# EAGLE schematic frontend7 (EAGLE 8.5.2)
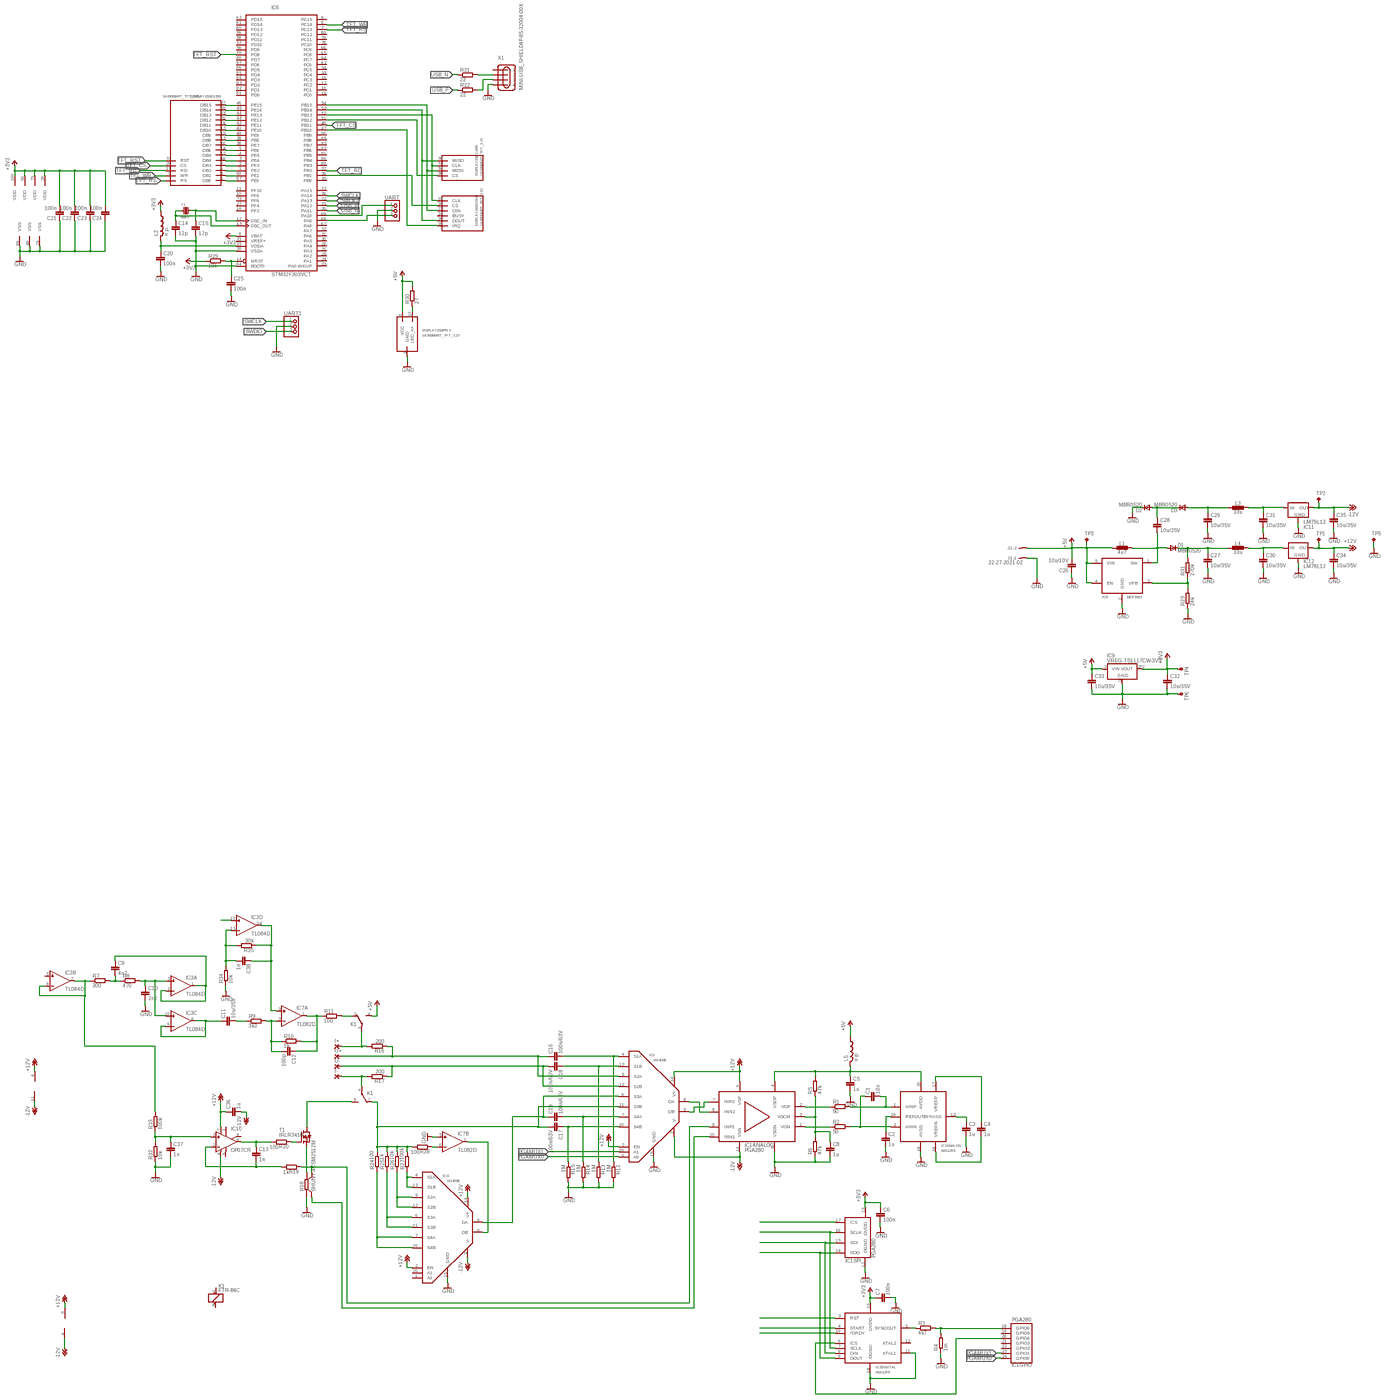
[diagram p0: schematic, sheet 1, overview]
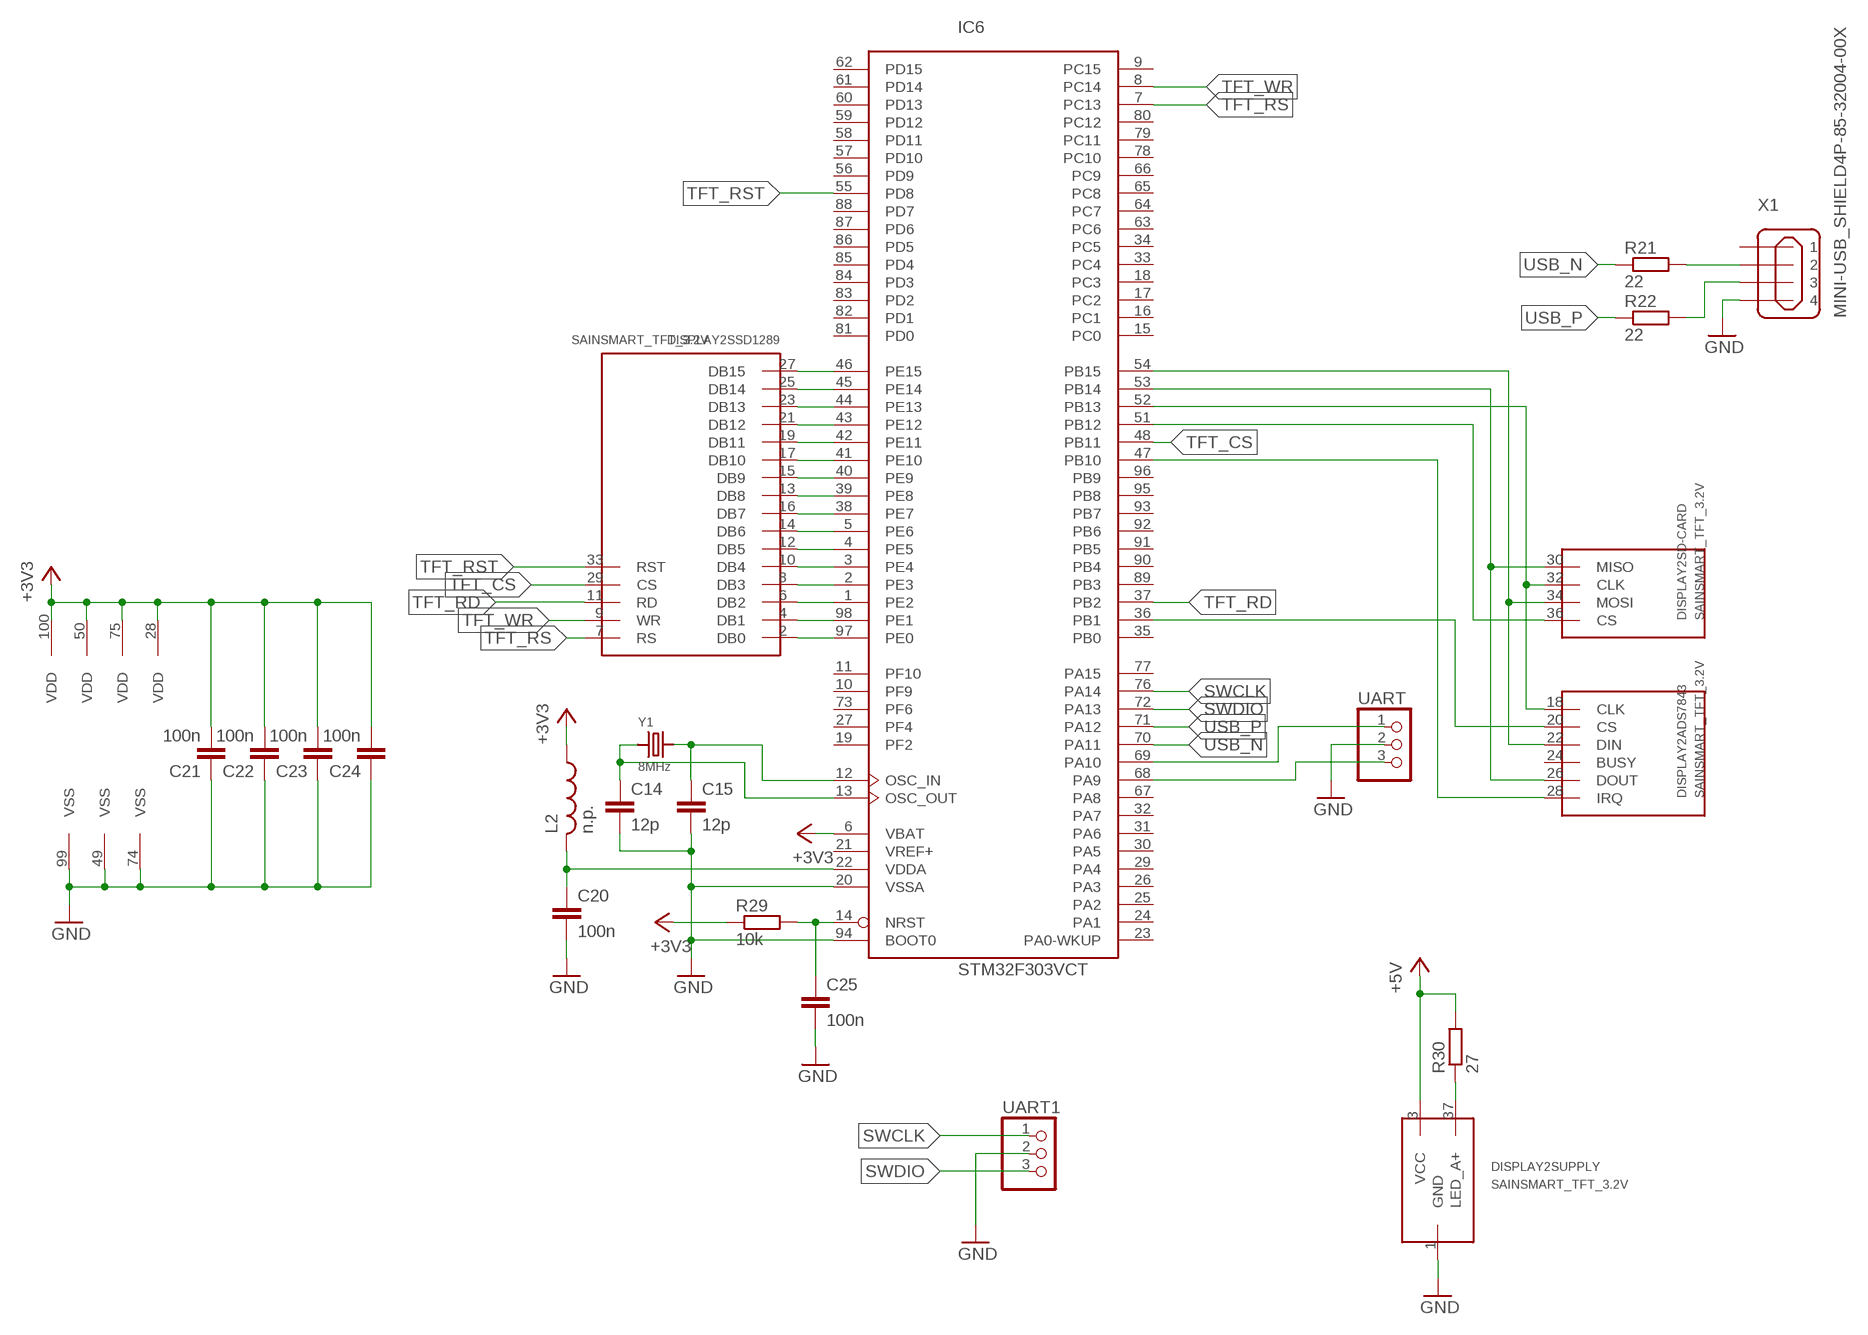
[diagram p1: schematic, sheet 1, part 1 of 4]
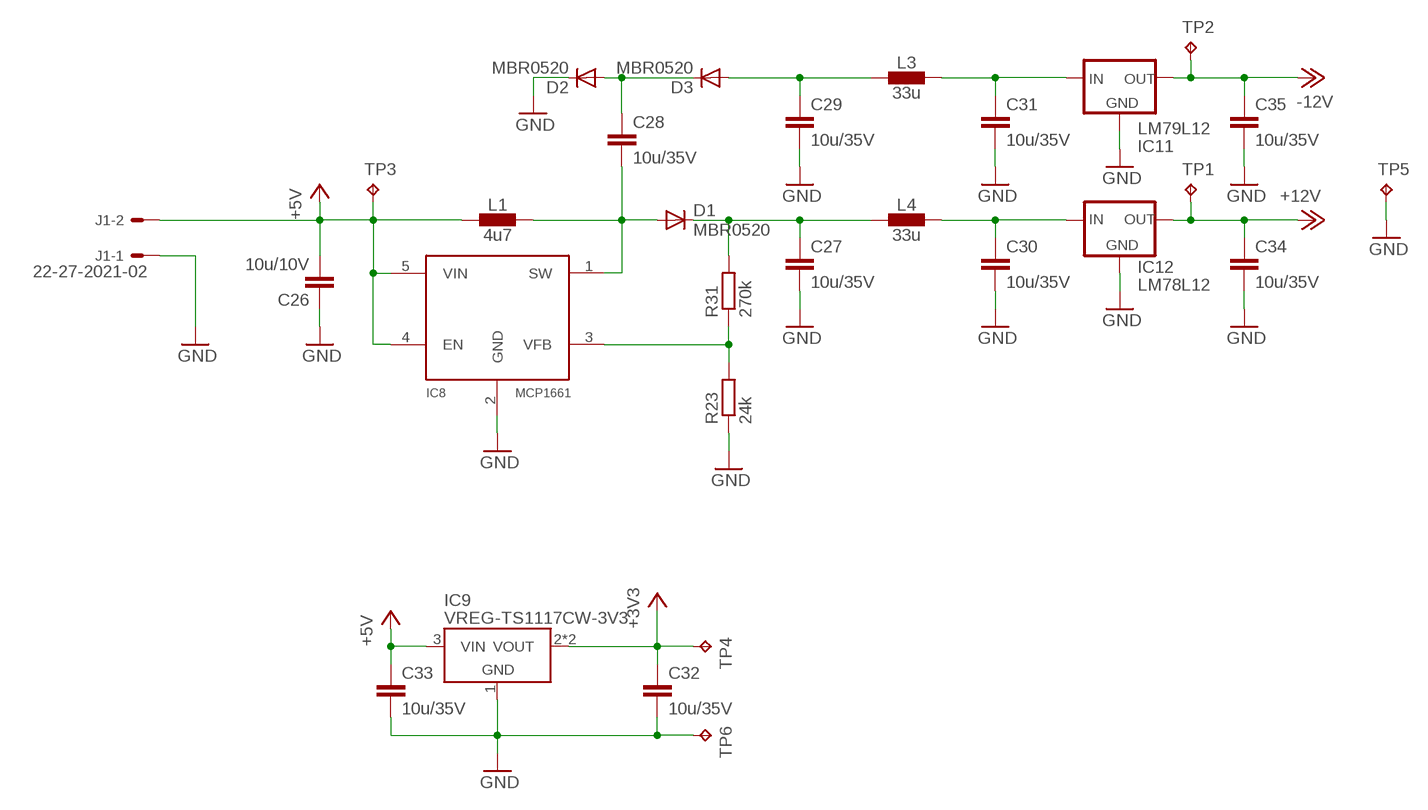
[diagram p2: schematic, sheet 1, part 2 of 4]
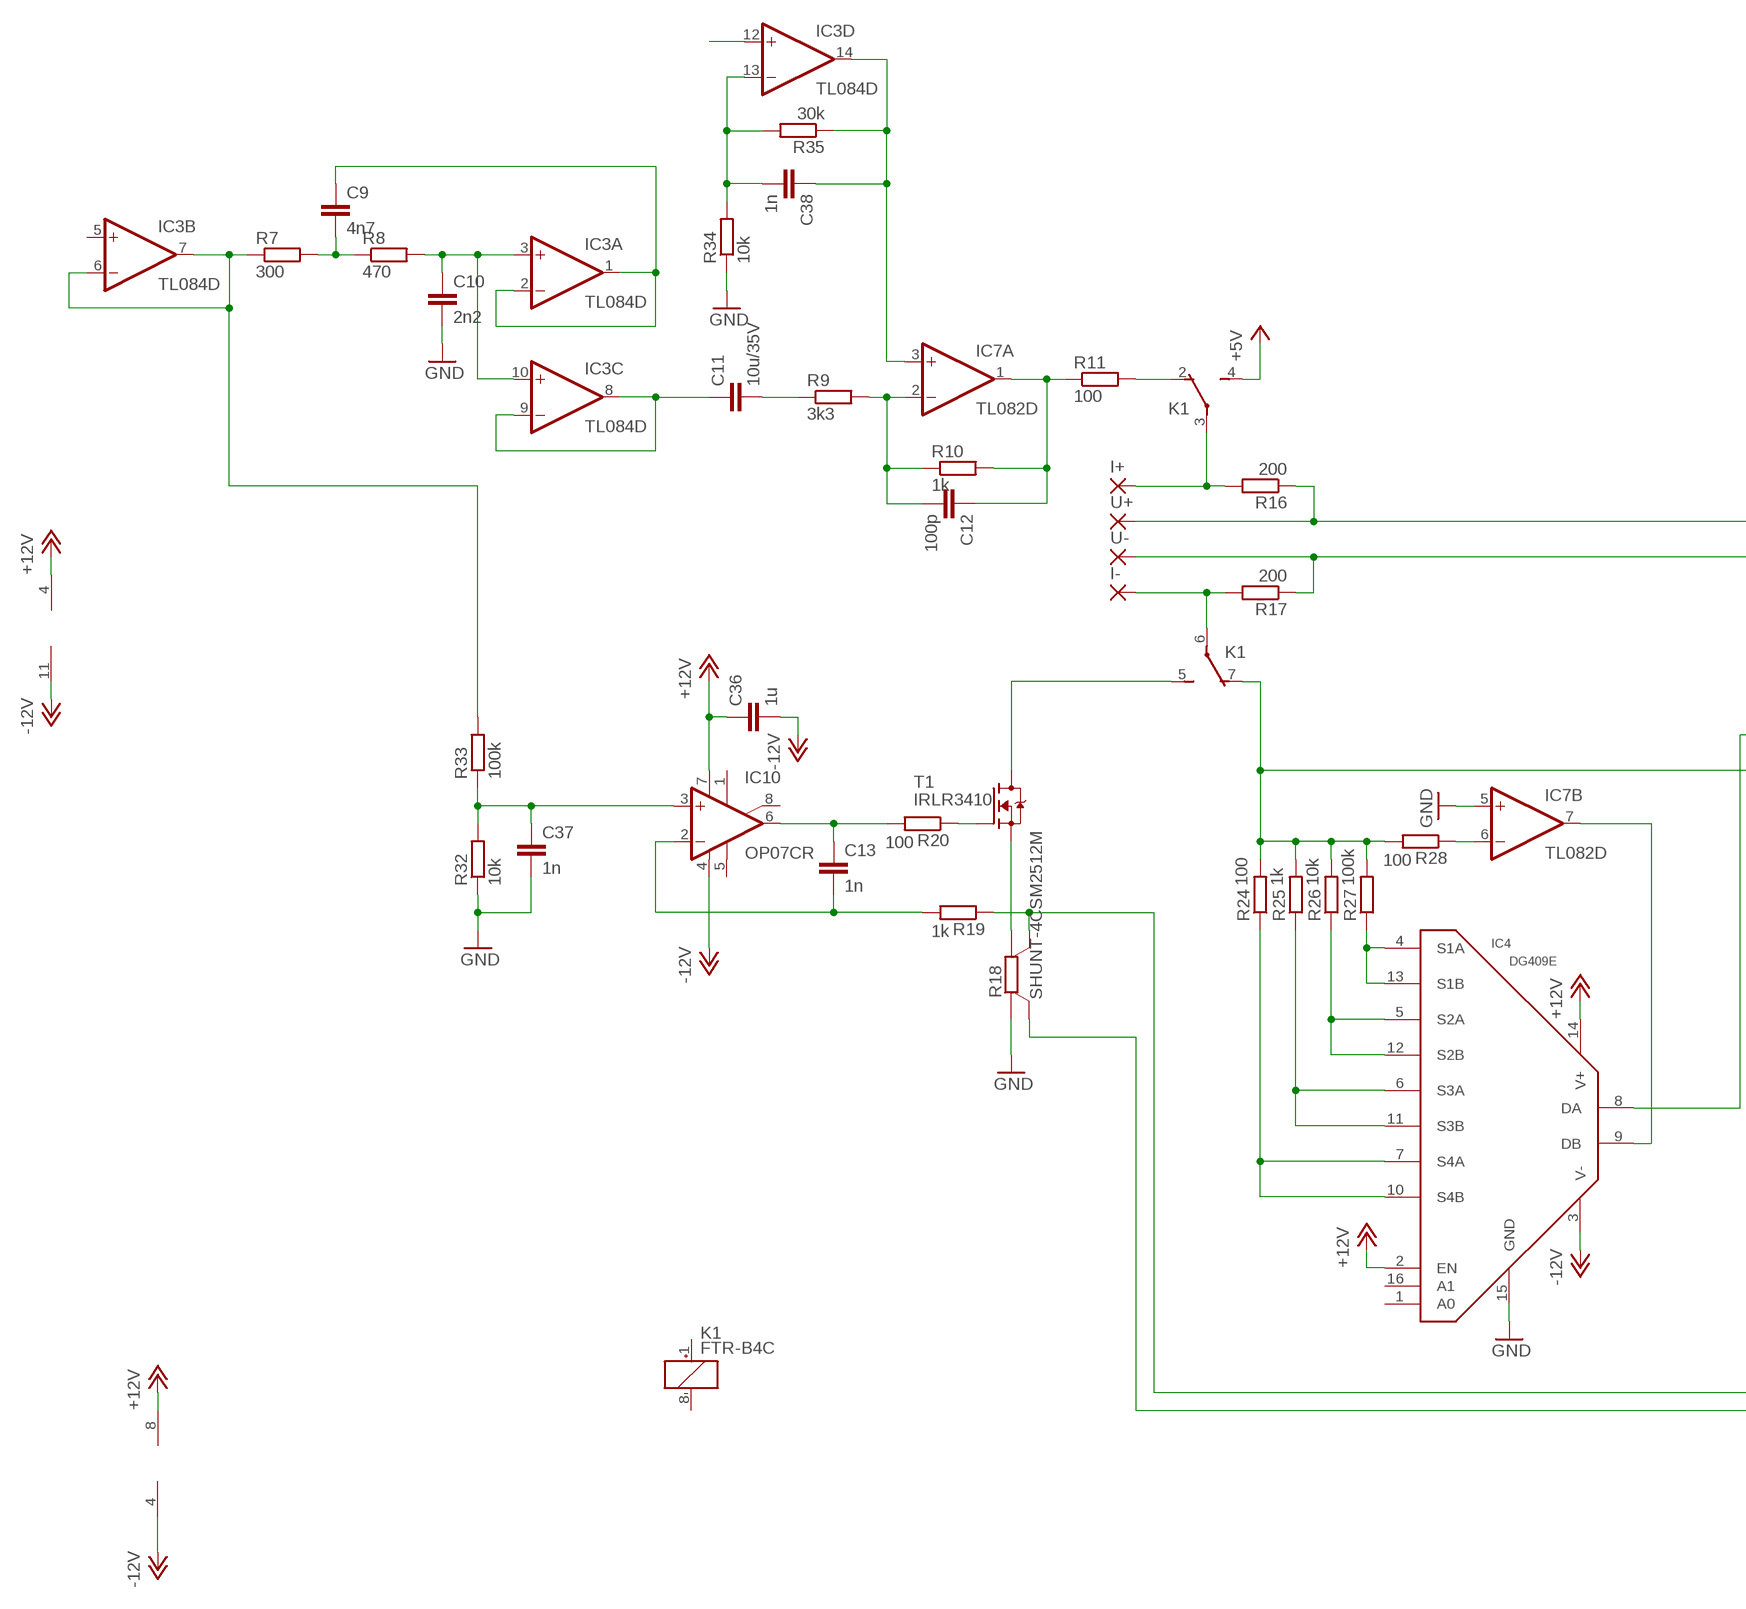
[diagram p3: schematic, sheet 1, part 3 of 4]
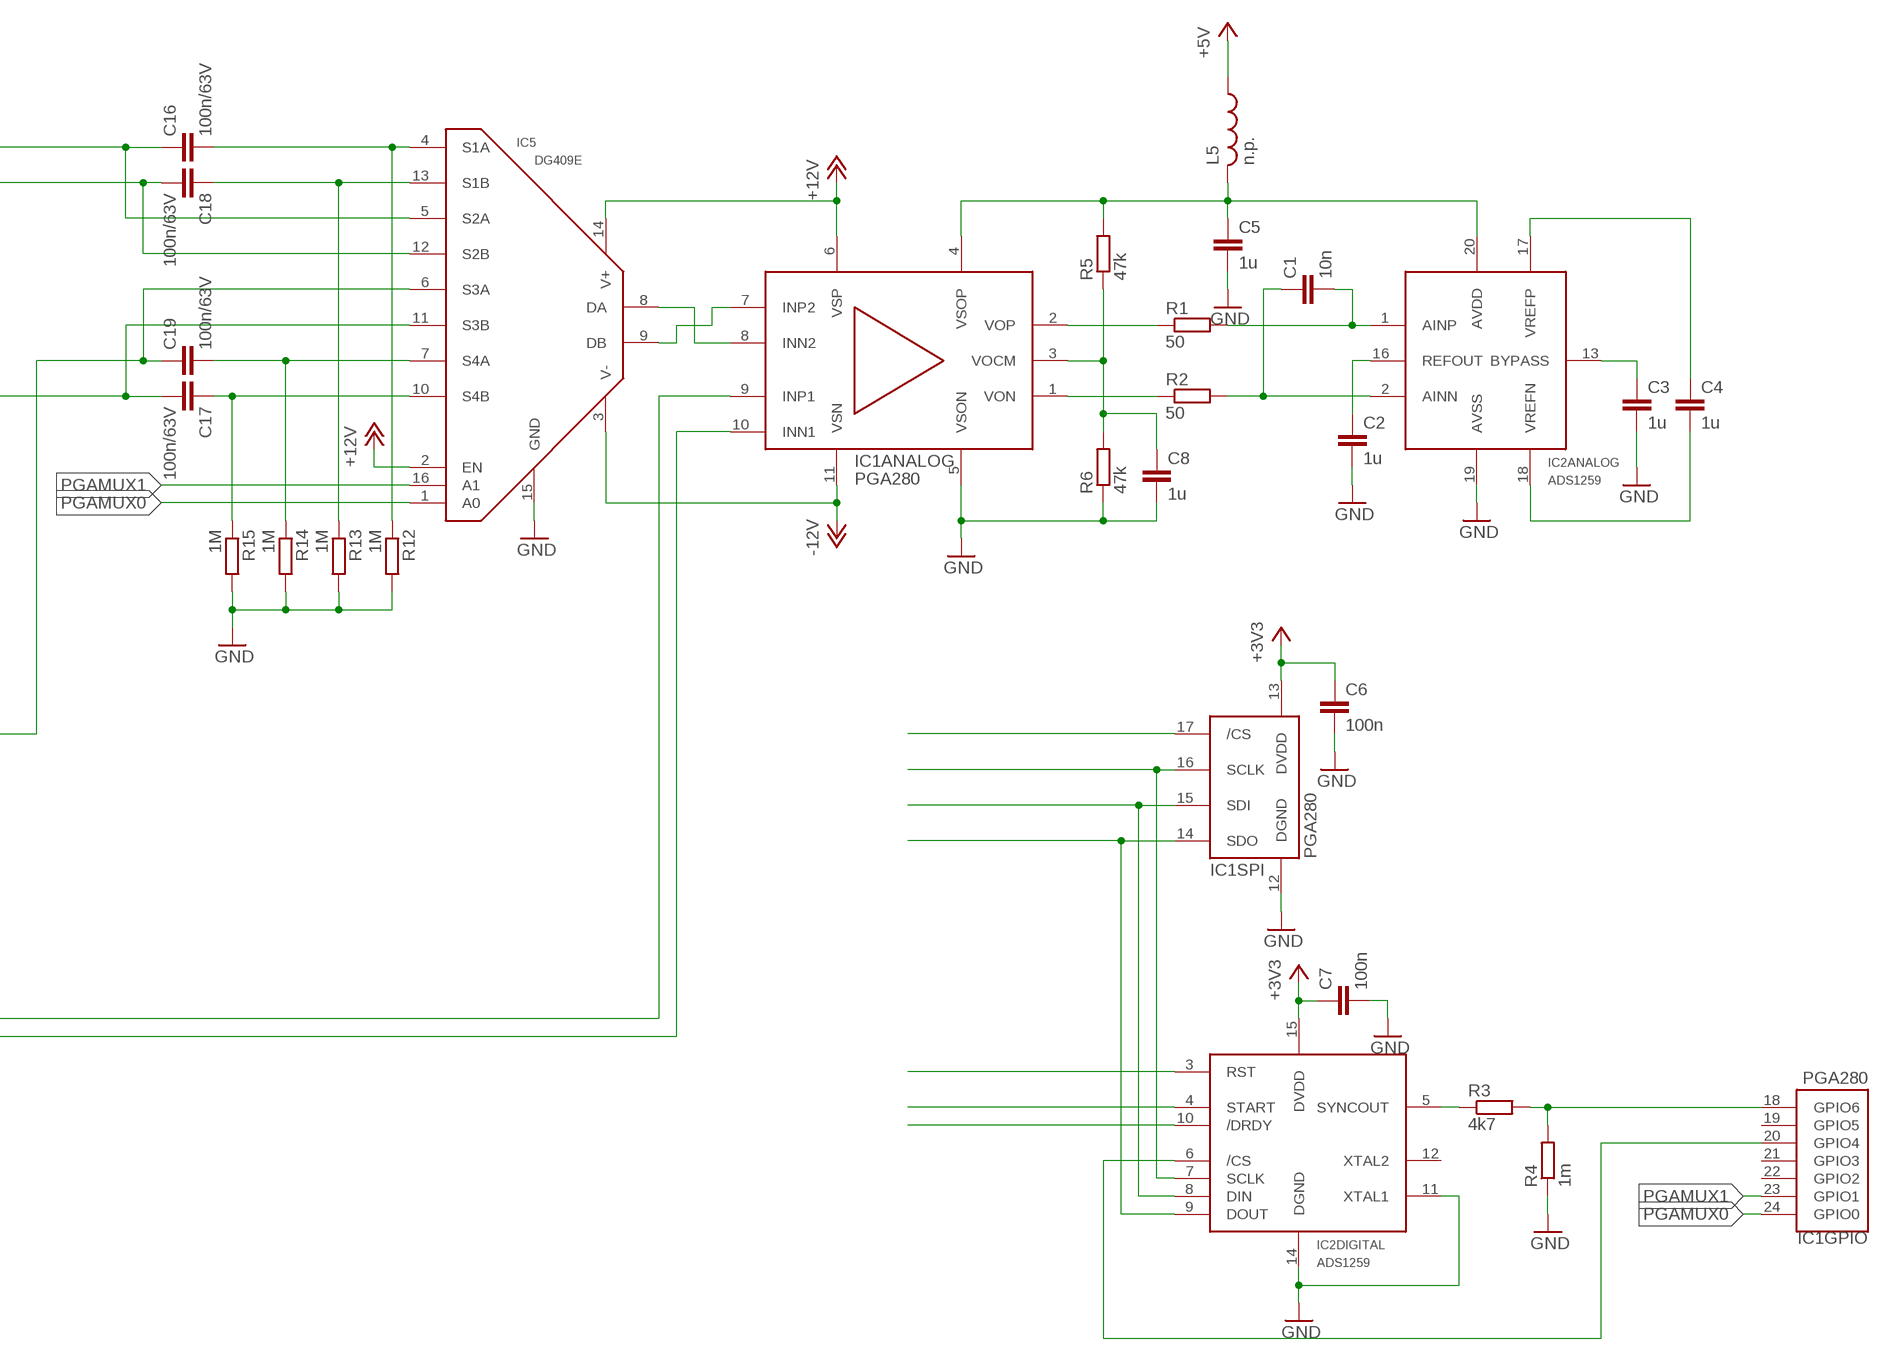
[diagram p4: schematic, sheet 1, part 4 of 4]

## Parts
C1  10n  C-EUC0603K  [C0603K]
C2  1u  C-EUC0603K  [C0603K]
C3  1u  C-EUC0603K  [C0603K]
C4  1u  C-EUC0603K  [C0603K]
C5  1u  C-EUC0603K  [C0603K]
C6  100n  C-EUC0603K  [C0603K]
C7  100n  C-EUC0603K  [C0603K]
C8  1u  C-EUC0603K  [C0603K]
C9  4n7  C-EUC0603K  [C0603K]
C10  2n2  C-EUC0603K  [C0603K]
C11  10u/35V  C-EUC1206K  [C1206K]
C12  100p  C-EUC0603K  [C0603K]
C13  1n  C-EUC0603K  [C0603K]
C14  12p  C-EUC0603K  [C0603K]
C15  12p  C-EUC0603K  [C0603K]
C16  100n/63V  C-EUC1206K  [C1206K]
C17  100n/63V  C-EUC1206K  [C1206K]
C18  100n/63V  C-EUC1206K  [C1206K]
C19  100n/63V  C-EUC1206K  [C1206K]
C20  100n  C-EUC0603K  [C0603K]
C21  100n  C-EUC0603K  [C0603K]
C22  100n  C-EUC0603K  [C0603K]
C23  100n  C-EUC0603K  [C0603K]
C24  100n  C-EUC0603K  [C0603K]
C25  100n  C-EUC0603K  [C0603K]
C26  10u/10V  C-EUC1206K  [C1206K]
C27  10u/35V  C-EUC1206K  [C1206K]
C28  10u/35V  C-EUC1206K  [C1206K]
C29  10u/35V  C-EUC1206K  [C1206K]
C30  10u/35V  C-EUC1206K  [C1206K]
C31  10u/35V  C-EUC1206K  [C1206K]
C32  10u/35V  C-EUC1206K  [C1206K]
C33  10u/35V  C-EUC1206K  [C1206K]
C34  10u/35V  C-EUC1206K  [C1206K]
C35  10u/35V  C-EUC1206K  [C1206K]
C36  1u  C-EUC0603K  [C0603K]
C37  1n  C-EUC0603K  [C0603K]
C38  1n  C-EUC0603K  [C0603K]
D1  MBR0520  DIODE-SOD123  [SOD123]
D2  MBR0520  DIODE-SOD123  [SOD123]
D3  MBR0520  DIODE-SOD123  [SOD123]
DISPLAY2  SAINSMART_TFT_3.2V  [SAINSMART_ANGLED]
I+  SMD5  [SMD2,54-5,08]
I-  SMD5  [SMD2,54-5,08]
IC1  PGA280  [TSSOP24]
IC2  ADS1259  [TSSOP20]
IC3  TL084D  [SO14]
IC4  DG409E  [TSSOP16]
IC5  DG409E  [TSSOP16]
IC6  STM32F303VCT  [LQFP100]
IC7  TL082D  [SO08]
IC8  MCP1661  [SOT23-5]
IC9  VREG-TS1117CW-3V3  [SOT223]
IC10  OP07CR  [SO08]
IC11  LM79L12  79LXX-SO_INALL  [SO08]
IC12  LM78L12  78LXX-SO8_GNDALL  [SO08]
J1  22-27-2021-02  [6410-02]
K1  FTR-B4C  [FTR-B4C]
L1  4u7  INDUCTOR-NR60XX  [L_NR60XX]
L2  n.p.  INDUCTOR0603  [R0603]
L3  33u  INDUCTOR-1212  [L_1212]
L4  33u  INDUCTOR-1212  [L_1212]
L5  n.p.  INDUCTOR0603  [R0603]
R1  50  R-EU_R0603  [R0603]
R2  50  R-EU_R0603  [R0603]
R3  4k7  R-EU_R0603  [R0603]
R4  1m  R-EU_R0603  [R0603]
R5  47k  R-EU_R0603  [R0603]
R6  47k  R-EU_R0603  [R0603]
R7  300  R-EU_R0603  [R0603]
R8  470  R-EU_R0603  [R0603]
R9  3k3  R-EU_R0603  [R0603]
R10  1k  R-EU_R0603  [R0603]
R11  100  R-EU_R0603  [R0603]
R12  1M  R-EU_R0603  [R0603]
R13  1M  R-EU_R0603  [R0603]
R14  1M  R-EU_R0603  [R0603]
R15  1M  R-EU_R0603  [R0603]
R16  200  R-EU_R0603  [R0603]
R17  200  R-EU_R0603  [R0603]
R18  SHUNT-4CSM2512M  [CSM2512M]
R19  1k  R-EU_R0603  [R0603]
R20  100  R-EU_R0603  [R0603]
R21  22  R-EU_R0603  [R0603]
R22  22  R-EU_R0603  [R0603]
R23  24k  R-EU_R0603  [R0603]
R24  100  R-EU_R0603  [R0603]
R25  1k  R-EU_R0603  [R0603]
R26  10k  R-EU_R0603  [R0603]
R27  100k  R-EU_R0603  [R0603]
R28  100  R-EU_R0603  [R0603]
R29  10k  R-EU_R0603  [R0603]
R30  27  R-EU_R1206  [R1206]
R31  270k  R-EU_R0603  [R0603]
R32  10k  R-EU_R0603  [R0603]
R33  100k  R-EU_R0603  [R0603]
R34  10k  R-EU_R0603  [R0603]
R35  30k  R-EU_R0603  [R0603]
T1  IRLR3410  [TO252]
TP1  TPB2,54  [B2,54]
TP2  TPB2,54  [B2,54]
TP3  TPB2,54  [B2,54]
TP4  TPB2,54  [B2,54]
TP5  TPB2,54  [B2,54]
TP6  TPB2,54  [B2,54]
U+  SMD5  [SMD2,54-5,08]
U-  SMD5  [SMD2,54-5,08]
UART  PINHD-1X3  [1X03]
UART1  PINHD-1X3  [1X03]
X1  MINI-USB_SHIELD4P-85-32004-00X  [85-32004-00X]
Y1  8MHz  CRYSTAL.3.2X2.5MM  [3.2X2.5MM]

## Nets
+3V3: C6.1 C7.1 C21.2 C22.2 C23.2 C24.2 C32.1 IC1.13(SPI:DVDD) IC2.15(DIGITAL:DVDD) IC6.6(VBAT) IC6.28(VDD) IC6.50(VDD) IC6.75(VDD) IC6.100(VDD) IC9.2(VOUT) IC9.4(VOUT) L2.1 R29.1 TP4.TP
+5V: C26.2 C33.1 DISPLAY2.3(SUPPLY:VCC) IC8.4(EN) IC8.5(VIN) IC9.3(VIN) J1.2 K1.4(-1:S) L1.1 L5.1 R30.2 TP3.TP
+12V: C34.1 C36.1 IC1.6(ANALOG:VSP) IC3.4(P:V+) IC4.2(EN) IC4.14(V+) IC5.2(EN) IC5.14(V+) IC7.8(P:V+) IC10.7(V+) IC12.1(OUT) TP1.TP
-12V: C35.1 C36.2 IC1.11(ANALOG:VSN) IC3.11(P:V-) IC4.3(V-) IC5.3(V-) IC7.4(P:V-) IC10.4(V-) IC11.1(OUT) TP2.TP
AIN_N: C1.1 IC2.2(ANALOG:AINN) R2.2
AIN_P: C1.2 IC2.1(ANALOG:AINP) R1.2
BYPASS: C3.1 IC2.13(ANALOG:BYPASS)
CS_ADS: IC1.20(GPIO:GPIO4) IC2.6(DIGITAL:/CS)
CS_PGA: IC1.17(SPI:/CS)
DAC2: IC3.12(D:+IN)
DRDY: IC2.10(DIGITAL:/DRDY)
EXT4: C20.1 IC6.22(VDDA) L2.2
GND: C2.2 C3.2 C5.2 C6.2 C7.2 C8.2 C10.2 C14.2 C15.2 C20.2 C21.1 C22.1 C23.1 C24.1 C25.2 C26.1 C27.2 C29.2 C30.2 C31.2 C32.2 C33.2 C34.2 C35.2 C37.2 D2.C DISPLAY2.1(SUPPLY:GND) IC1.5(ANALOG:VSON) IC1.12(SPI:DGND) IC2.11(DIGITAL:XTAL1) IC2.14(DIGITAL:DGND) IC2.19(ANALOG:AVSS) IC4.15(GND) IC5.15(GND) IC6.20(VSSA) IC6.49(VSS) IC6.74(VSS) IC6.94(BOOT0) IC6.99(VSS) IC7.5(B:+IN) IC8.2(GND) IC9.1(GND) IC11.5(GND) IC12.2(GND) IC12.3(GND) IC12.6(GND) IC12.7(GND) J1.1 R4.1 R6.1 R12.2 R13.2 R14.2 R15.2 R18.I2 R23.1 R32.1 R34.1 TP5.TP TP6.TP UART1.2 UART.2 X1.4
I+: I+.1(P) K1.3(-1:P) R16.2
I-: I-.1(P) K1.6(-2:P) R17.2
N$1: IC3.6(B:-IN) IC3.7(B:OUT) R7.1 R33.2
N$2: C9.2 R7.2 R8.1
N$3: C10.1 IC3.3(A:+IN) IC3.10(C:+IN) R8.2
N$4: C9.1 IC3.1(A:OUT) IC3.2(A:-IN)
N$5: C16.2 IC5.4(S1A) R12.1
N$6: C11.1 IC3.8(C:OUT) IC3.9(C:-IN)
N$7: C11.2 R9.1
N$8: C12.2 IC7.2(A:-IN) R9.2 R10.1
N$9: C12.1 IC7.1(A:OUT) R10.2 R11.1
N$10: IC1.8(ANALOG:INN2) IC5.8(DA)
N$11: IC1.7(ANALOG:INP2) IC5.9(DB)
N$12: C18.1 IC5.13(S1B) R13.1
N$13: C37.1 IC10.3(+IN) R32.2 R33.1
N$14: C38.1 IC3.14(D:OUT) IC7.3(A:+IN) R35.1
N$15: C17.1 IC5.10(S4B) R15.1
N$16: C19.2 IC5.7(S4A) R14.1
N$17: C38.2 IC3.13(D:-IN) R34.2 R35.2
N$18: C19.1 IC4.8(DA) IC5.6(S3A)
N$19: IC1.10(ANALOG:INN1) R18.S2
N$20: IC1.9(ANALOG:INP1) R18.S1 R19.1
N$21: IC4.9(DB) IC7.7(B:OUT)
N$23: K1.2(-1:O) R11.2
N$24: K1.5(-2:S) T1.3(D)
N$25: R18.I1 T1.2(S)
N$26: C13.2 IC10.2(-IN) R19.2
N$27: DISPLAY2.2(SSD1289:DB0) IC6.97(PE0)
N$28: C13.1 IC10.6(OUT) R20.2
N$29: R20.1 T1.1(G)
N$30: DISPLAY2.4(SSD1289:DB1) IC6.98(PE1)
N$31: DISPLAY2.6(SSD1289:DB2) IC6.1(PE2)
N$32: DISPLAY2.8(SSD1289:DB3) IC6.2(PE3)
N$33: DISPLAY2.10(SSD1289:DB4) IC6.3(PE4)
N$34: IC7.6(B:-IN) R28.1
N$35: C17.2 IC5.11(S3B) K1.7(-2:O) R24.2 R25.2 R26.2 R27.2 R28.2
N$36: IC4.4(S1A) IC4.13(S1B) R27.1
N$37: IC4.5(S2A) IC4.12(S2B) R26.1
N$38: IC4.6(S3A) IC4.11(S3B) R25.1
N$39: IC4.7(S4A) IC4.10(S4B) R24.1
N$40: DISPLAY2.12(SSD1289:DB5) IC6.4(PE5)
N$41: DISPLAY2.14(SSD1289:DB6) IC6.5(PE6)
N$44: DISPLAY2.16(SSD1289:DB7) IC6.38(PE7)
N$45: DISPLAY2.13(SSD1289:DB8) IC6.39(PE8)
N$46: DISPLAY2.15(SSD1289:DB9) IC6.40(PE9)
N$47: DISPLAY2.17(SSD1289:DB10) IC6.41(PE10)
N$48: DISPLAY2.19(SSD1289:DB11) IC6.42(PE11)
N$49: DISPLAY2.21(SSD1289:DB12) IC6.43(PE12)
N$50: DISPLAY2.23(SSD1289:DB13) IC6.44(PE13)
N$51: DISPLAY2.25(SSD1289:DB14) IC6.45(PE14)
N$52: DISPLAY2.27(SSD1289:DB15) IC6.46(PE15)
N$53: C15.1 IC6.12(OSC_IN) Y1.3
N$54: C14.1 IC6.13(OSC_OUT) Y1.1
N$55: R21.2 X1.2
N$56: R22.2 X1.3
N$57: DISPLAY2.22(ADS7843:DIN) DISPLAY2.34(SD-CARD:MOSI) IC6.54(PB15)
N$58: DISPLAY2.26(ADS7843:DOUT) DISPLAY2.30(SD-CARD:MISO) IC6.53(PB14)
N$59: DISPLAY2.18(ADS7843:CLK) DISPLAY2.32(SD-CARD:CLK) IC6.52(PB13)
N$60: C25.1 IC6.14(NRST) R29.2
N$61: DISPLAY2.37(SUPPLY:LED_A+) R30.1
N$62: C5.1 IC1.4(ANALOG:VSOP) IC2.20(ANALOG:AVDD) L5.2 R5.2
N$66: DISPLAY2.36(SD-CARD:CS) IC6.51(PB12)
N$67: DISPLAY2.20(ADS7843:CS) IC6.36(PB1)
N$68: C28.1 D2.A D3.C
N$69: C29.1 D3.A L3.1
N$70: C27.1 D1.C L4.1 R31.2
N$71: IC8.3(VFB) R23.2 R31.1
N$72: DISPLAY2.28(ADS7843:IRQ) IC6.47(PB10)
N$73: C30.1 IC12.8(IN) L4.2
N$74: C31.1 IC11.2(IN) IC11.3(IN) IC11.6(IN) IC11.7(IN) L3.2
PGAMUX0: IC1.24(GPIO:GPIO0) IC5.1(A0)
PGAMUX1: IC1.23(GPIO:GPIO1) IC5.16(A1)
REFN: C4.2 IC2.18(ANALOG:VREFN)
REFOUT: C2.1 IC2.16(ANALOG:REFOUT)
REFP: C4.1 IC2.17(ANALOG:VREFP)
RST: IC2.3(DIGITAL:RST)
RX: IC6.69(PA10) UART.1
SCLK: IC1.16(SPI:SCLK) IC2.7(DIGITAL:SCLK)
SDI: IC1.15(SPI:SDI) IC2.8(DIGITAL:DIN)
SDO: IC1.14(SPI:SDO) IC2.9(DIGITAL:DOUT)
START: IC2.4(DIGITAL:START)
SWCLK: IC6.76(PA14) UART1.1
SWDIO: IC6.72(PA13) UART1.3
SWITCH_NODE: C28.2 D1.A IC8.1(SW) L1.2
SYNCIN: IC1.18(GPIO:GPIO6) R3.2 R4.2
SYNCOUT: IC2.5(DIGITAL:SYNCOUT) R3.1
TFT_CS: DISPLAY2.29(SSD1289:CS) IC6.48(PB11)
TFT_RD: DISPLAY2.11(SSD1289:RD) IC6.37(PB2)
TFT_RS: DISPLAY2.7(SSD1289:RS) IC6.7(PC13)
TFT_RST: DISPLAY2.33(SSD1289:RST) IC6.55(PD8)
TFT_WR: DISPLAY2.9(SSD1289:WR) IC6.8(PC14)
TX: IC6.68(PA9) UART.3
U+: C16.1 IC5.5(S2A) R16.1 U+.1(P)
U-: C18.2 IC5.12(S2B) R17.1 U-.1(P)
USB_N: IC6.70(PA11) R21.1
USB_P: IC6.71(PA12) R22.1
VO_N: IC1.1(ANALOG:VON) R2.1
VO_P: IC1.2(ANALOG:VOP) R1.1
VOCM: C8.1 IC1.3(ANALOG:VOCM) R5.1 R6.2
Unconnected: DISPLAY2.24(ADS7843:BUSY) IC1.19(GPIO:GPIO5) IC1.21(GPIO:GPIO3) IC1.22(GPIO:GPIO2) IC2.12(DIGITAL:XTAL2) IC3.5(B:+IN) IC4.1(A0) IC4.16(A1) IC6.9(PC15) IC6.10(PF9) IC6.11(PF10) IC6.15(PC0) IC6.16(PC1) IC6.17(PC2) IC6.18(PC3) IC6.19(PF2) IC6.23(PA0-WKUP) IC6.24(PA1) IC6.25(PA2) IC6.26(PA3) IC6.27(PF4) IC6.29(PA4) IC6.30(PA5) IC6.31(PA6) IC6.32(PA7) IC6.33(PC4) IC6.34(PC5) IC6.35(PB0) IC6.56(PD9) IC6.57(PD10) IC6.58(PD11) IC6.59(PD12) IC6.60(PD13) IC6.61(PD14) IC6.62(PD15) IC6.63(PC6) IC6.64(PC7) IC6.65(PC8) IC6.66(PC9) IC6.67(PA8) IC6.73(PF6) IC6.77(PA15) IC6.78(PC10) IC6.79(PC11) IC6.80(PC12) IC6.81(PD0) IC6.82(PD1) IC6.83(PD2) IC6.84(PD3) IC6.85(PD4) IC6.86(PD5) IC6.87(PD6) IC6.88(PD7) IC6.89(PB3) IC6.90(PB4) IC6.91(PB5) IC6.92(PB6) IC6.93(PB7) IC6.95(PB8) IC6.96(PB9) IC10.1(ON1) IC10.5(OPT) IC10.8(ON2) K1.1(K:+) K1.8(K:-) X1.1 X1.M1(S1) X1.M2(S2)

## Power pins joined to a net without a drawn wire
VREF+: IC6.21(VREF+)

## Library data of the parts
C1-C38 = rcl:C-EU: CAPACITOR, European symbol
D1-D3 = diode:DIODE-: DIODE
DISPLAY2 = sainsmart:SAINSMART_TFT_3.2
I+ I- U+ U- = wirepad:SMD5: SMD PAD
IC1 = ti-analog:PGA280
IC2 = ti-analog:ADS1259
IC3 = linear:TL084: OP AMP
IC4 IC5 = vishay-analog:DG409
IC6 = micro-stm_v3:STM32F303V*T: ARM 32-bit Cortex™-M3 CPU 72 MHz maximum frequency 128 to 256 Kbytes of Flash memory 32 to 40 kbytes of SRAM 87 GPIOs 2.0 to 3.6 V application supply
IC7 = linear:TL082: OP AMP Data sheet <http://www.ti.com/lit/ds/symlink/tl084a . pdf>; DATA_SHEET: <a href="http://www.ti.com/lit/ds/symlink/tl084a.pdf"> Data sheet </a>
IC8 = switching:MCP1661
IC9 = we-power-mod:VREG: Voltage Regulators (LDOs, Switching Converters...) LDOs Taiwan Semi TS1117 800mA max 15V - compatible On Semi NCP1117 1A max 20V - compatible Diodes AP2111H 0.6A max 6V (0.25V@0.6A) - compatible Diodes AP2114H 1A max 6V (0.45V@1A) Taiwan Semi TS9011 250mA max 12V - compatible Diodes AP2210 300mA max 15V - compatible Microchip MCP1700 250mA max 6.5V - compatible Microchip MCP1702 250mA max 13V - compatible Microchip MCP1703 250mA max 16V - compatible Microchip MCP1754 150mA max 16V Taiwan Semi TS5204 150mA max 16V (low noise) DC/DC Converter Modules Recom R-78Ex.x-1.0-W36 1A max 28V - compatible CUI V78xx-2000 2A max 18V Murata OKI-78SR-x.x/1.5-W36 1.5A max 36V
IC10 = linear:OP07*: OP AMP
IC11 = v-reg-3:79LXX: VOLTAGE REGULATOR
IC12 = v-reg-3:78LXX: VOLTAGE REGULATOR
J1 = con-molex:22-?-02: CONNECTOR wire to board 2.54 mm (.1 inch) pitch header; OC_FARNELL: unknown; OC_NEWARK: unknown
K1 = relay:FTR-B4: ULTRA MINIATURE RELAY 2 POLES - 2 A (Slim Profile Signal Relay) FUJITSU FTR-B4 SERIES Source: FTR-B4.pdf
L1 L3 L4 = we-power:INDUCTOR: Power Inductors Taiyo Yuden NR6028 NR6028T0R9N - 0.9uH, Ir=6.6A NR6028T1R5N - 1.5uH, Ir=5.0A NR6028T2R2N - 2.2uH, Ir=4.2A NR6028T3R0N - 3.0uH, Ir=3.6A NR6028T4R7M - 4.7uH, Ir=2.7A NR6028T6R0M - 6.0uH, Ir=2.5A NR6028T100M - 10uH, Ir=1.9A NR6028T150M - 15uH, Ir=1.6A NR6028T220M - 22uH, Ir=1.3A NR6028T330M - 33uH, Ir=1.1A NR6028T470M - 47uH, Ir=0.95A NR6028T680M - 68uH, Ir=0.76A NR6028T101M - 100uH, Ir=0.62A Taiyo Yuden NR6045 NR6045T1R0N - 1.0uH, Ir=8.5A NR6045T1R3N - 1.3uH, Ir=8.0A NR6045T1R8N - 1.8uH, Ir=7.0A NR6045T2R3N - 2.3uH, Ir=6.0A NR6045T3R0N - 3.0uH, Ir=5.0A NR6045T4R5M - 4.5uH, Ir=4.0A NR6045T6R3M - 6.3uH, Ir=3.8A NR6045T100M - 10uH, Ir=3.0A NR6045T150M - 15uH, Ir=2.3A NR6045T220M - 22uH, Ir=1.9A NR6045T330M - 33uH, Ir=1.5A NR6045T470M - 47uH, Ir=1.3A NR6045T680M - 68uH, Ir=1.0A NR6045T101M - 100uH, Ir=0.8A
L2 L5 = xmaker:INDUCTOR: Inductor
R1-R6 R16 R17 R21 R22 R29 R30 = resistor:R-EU_: RESISTOR, European symbol
R7-R15 R19 R20 R23-R28 R31-R35 = rcl:R-EU_: RESISTOR, European symbol
R18 = R-Vishay:SHUNT-4
T1 = transistor-ir:IRLR3410
TP1-TP6 = testpad:TP: Test pad
UART UART1 = pinhead:PINHD-1X3: PIN HEADER
X1 = con-cypressindustries:MINI-USB_SHIELD4P-: MINI USB 4 Pol. Source: www.cypressindustries.com; OC_FARNELL: unknown; OC_NEWARK: unknown
Y1 = abracon:CRYSTAL